# EAGLE design calip2 (EAGLE 7.5.0)
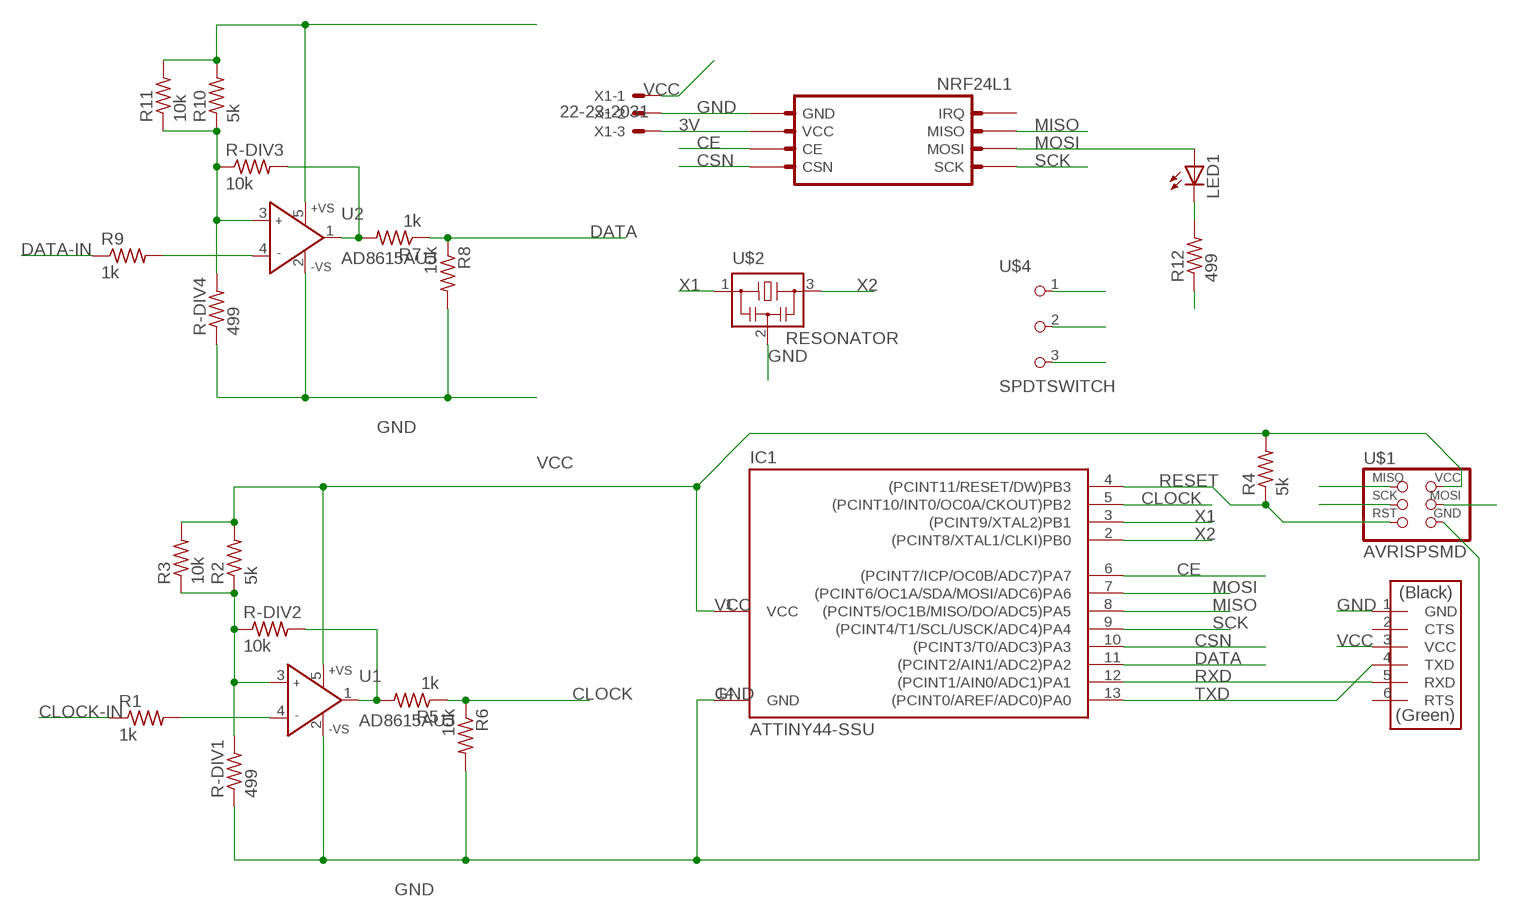
[diagram p0: schematic, sheet 1]

## Parts
IC1  ATTINY44-SSU  [SOIC14]
LED1  LEDSML1206  [SML1206]
NRF24L1  NRF  [NRF]
R1  1k  RES-US1206FAB  [R1206FAB]
R2  5k  RES-US1206FAB  [R1206FAB]
R3  10k  RES-US1206FAB  [R1206FAB]
R4  5k  RES-US1206FAB  [R1206FAB]
R5  1k  RES-US1206FAB  [R1206FAB]
R6  10k  RES-US1206FAB  [R1206FAB]
R7  1k  RES-US1206FAB  [R1206FAB]
R8  10k  RES-US1206FAB  [R1206FAB]
R9  1k  RES-US1206FAB  [R1206FAB]
R10  5k  RES-US1206FAB  [R1206FAB]
R11  10k  RES-US1206FAB  [R1206FAB]
R12  499  RES-US1206FAB  [R1206FAB]
R-DIV1  499  RES-US1206FAB  [R1206FAB]
R-DIV2  10k  RES-US1206FAB  [R1206FAB]
R-DIV3  10k  RES-US1206FAB  [R1206FAB]
R-DIV4  499  RES-US1206FAB  [R1206FAB]
U1  AD8615AUJ  [TSOT23-5]
U2  AD8615AUJ  [TSOT23-5]
U$1  AVRISPSMD  [2X03SMD]
U$2  RESONATOR  [EFOBM]
U$3  FTDI-SMD-HEADER  [1X06SMD]
U$4  SPDTSWITCH  [SPDTSWITCH]
X1  22-23-2031  [22-23-2031]

## Nets
3V: NRF24L1.2(VCC) X1.3
CE: IC1.6((PCINT7/ICP/OC0B/ADC7)PA7) NRF24L1.3(CE)
CLOCK: IC1.5((PCINT10/INT0/OC0A/CKOUT)PB2) R5.1 R6.1
CLOCK-IN: R1.1 U$4.2
CSN: IC1.10((PCINT3/T0/ADC3)PA3) NRF24L1.4(CSN)
DATA: IC1.11((PCINT2/AIN1/ADC2)PA2) R7.1 R8.1
DATA-IN: R9.1 U$4.3
GND: IC1.14(GND) NRF24L1.P$1(GND) R6.2 R8.2 R12.1 R-DIV1.1 R-DIV4.1 U1.2(-VS) U2.2(-VS) U$1.6(GND) U$2.2 U$3.1(GND) U$4.1 X1.2
MISO: IC1.8((PCINT5/OC1B/MISO/DO/ADC5)PA5) NRF24L1.7(MISO) U$1.1(MISO)
MOSI: IC1.7((PCINT6/OC1A/SDA/MOSI/ADC6)PA6) LED1.A NRF24L1.6(MOSI) U$1.4(MOSI)
N$1: R1.2 U1.4(IN-)
N$2: LED1.C R12.2
N$3: R2.1 R3.1 R-DIV1.2 R-DIV2.1 U1.3(IN+)
N$4: R5.2 R-DIV2.2 U1.1(OUT)
N$5: R7.2 R-DIV3.2 U2.1(OUT)
N$7: R10.1 R11.1 R-DIV3.1 R-DIV4.2 U2.3(IN+)
N$9: R9.2 U2.4(IN-)
RESET: IC1.4((PCINT11/RESET/DW)PB3) R4.1 U$1.5(RST)
RXD: IC1.12((PCINT1/AIN0/ADC1)PA1) U$3.5(RXD)
SCK: IC1.9((PCINT4/T1/SCL/USCK/ADC4)PA4) NRF24L1.5(SCK) U$1.3(SCK)
TXD: IC1.13((PCINT0/AREF/ADC0)PA0) U$3.4(TXD)
VCC: IC1.1(VCC) R2.2 R3.2 R4.2 R10.2 R11.2 U1.5(+VS) U2.5(+VS) U$1.2(VCC) U$3.3(VCC) X1.1
X1: IC1.3((PCINT9/XTAL2)PB1) U$2.1
X2: IC1.2((PCINT8/XTAL1/CLKI)PB0) U$2.3
Unconnected: NRF24L1.8(IRQ) U$3.2(CTS) U$3.6(RTS)

## Library data of the parts
IC1 = fab:ATTINY44
LED1 = led:LED: LED OSRAM: - CHIPLED LG R971, LG N971, LY N971, LG Q971, LY Q971, LO R971, LY R971 LH N974, LH R974 LS Q976, LO Q976, LY Q976 LO Q996 - Hyper CHIPLED LW Q18S LB Q993, LB Q99A, LB R99A - SideLED LS A670, LO A670, LY A670, LG A670, LP A670 LB A673, LV A673, LT A673, LW A673 LH A674 LY A675 LS A676, LA A676, LO A676, LY A676, LW A676 LS A679, LY A679, LG A679 - Hyper Micro SIDELED® LS Y876, LA Y876, LO Y876, LY Y876 LT Y87S - SmartLED LW L88C, LW L88S LB L89C, LB L89S, LG L890 LS L89K, LO L89K, LY L89K LS L896, LA L896, LO L896, LY L896 - TOPLED LS T670, LO T670, LY T670, LG T670, LP T670 LSG T670, LSP T670, LSY T670, LOP T670, LYG T670 LG T671, LOG T671, LSG T671 LB T673, LV T673, LT T673, LW T673 LH T674 LS T676, LA T676, LO T676, LY T676, LB T676, LH T676, LSB T676, LW T676 LB T67C, LV T67C, LT T67C, LS T67K, LO T67K, LY T67K, LW E67C LS E67B, LA E67B, LO E67B, LY E67B, LB E67C, LV E67C, LT E67C LW T67C LS T679, LY T679, LG T679 LS T770, LO T770, LY T770, LG T770, LP T770 LB T773, LV T773, LT T773, LW T773 LH T774 LS E675, LA E675, LY E675, LS T675 LS T776, LA T776, LO T776, LY T776, LB T776 LHGB T686 LT T68C, LB T68C - Hyper Mini TOPLED® LB M676 - Mini TOPLED Santana® LG M470 LS M47K, LO M47K, LY M47K Source: http://www.osram.convergy.de LUXEON: - LUMILED® LXK2-PW12-R00, LXK2-PW12-S00, LXK2-PW14-U00, LXK2-PW14-V00 LXK2-PM12-R00, LXK2-PM12-S00, LXK2-PM14-U00 LXK2-PE12-Q00, LXK2-PE12-R00, LXK2-PE12-S00, LXK2-PE14-T00, LXK2-PE14-U00 LXK2-PB12-K00, LXK2-PB12-L00, LXK2-PB12-M00, LXK2-PB14-N00, LXK2-PB14-P00, LXK2-PB14-Q00 LXK2-PR12-L00, LXK2-PR12-M00, LXK2-PR14-Q00, LXK2-PR14-R00 LXK2-PD12-Q00, LXK2-PD12-R00, LXK2-PD12-S00 LXK2-PH12-R00, LXK2-PH12-S00 LXK2-PL12-P00, LXK2-PL12-Q00, LXK2-PL12-R00 Source: www.luxeon.com KINGBRIGHT: KA-3528ASYC Source: www.kingbright.com
NRF24L1 = nrf24:NRF
R1-R12 R-DIV1-R-DIV4 = fab:RES-US: Resistor (US Symbol) Variants with postfix FAB are widened to allow the routing of internal traces
U1 U2 = parts:AD8615: Precision, 20 MHz, CMOS, Rail-to-Rail Input/Output Operational Amplifiers; RS: 796-8925
U$1 = fab:AVRISP
U$2 = fab:RESONATOR
U$3 = fab:FTDI-SMD-HEADER
U$4 = fab:SPDTSWITCH
X1 = con-molex:22-23-2031: .100" (2.54mm) Center Header - 3 Pin; MF: MOLEX; MPN: 22-23-2031; OC_FARNELL: 1462950; OC_NEWARK: 30C0862

## Board
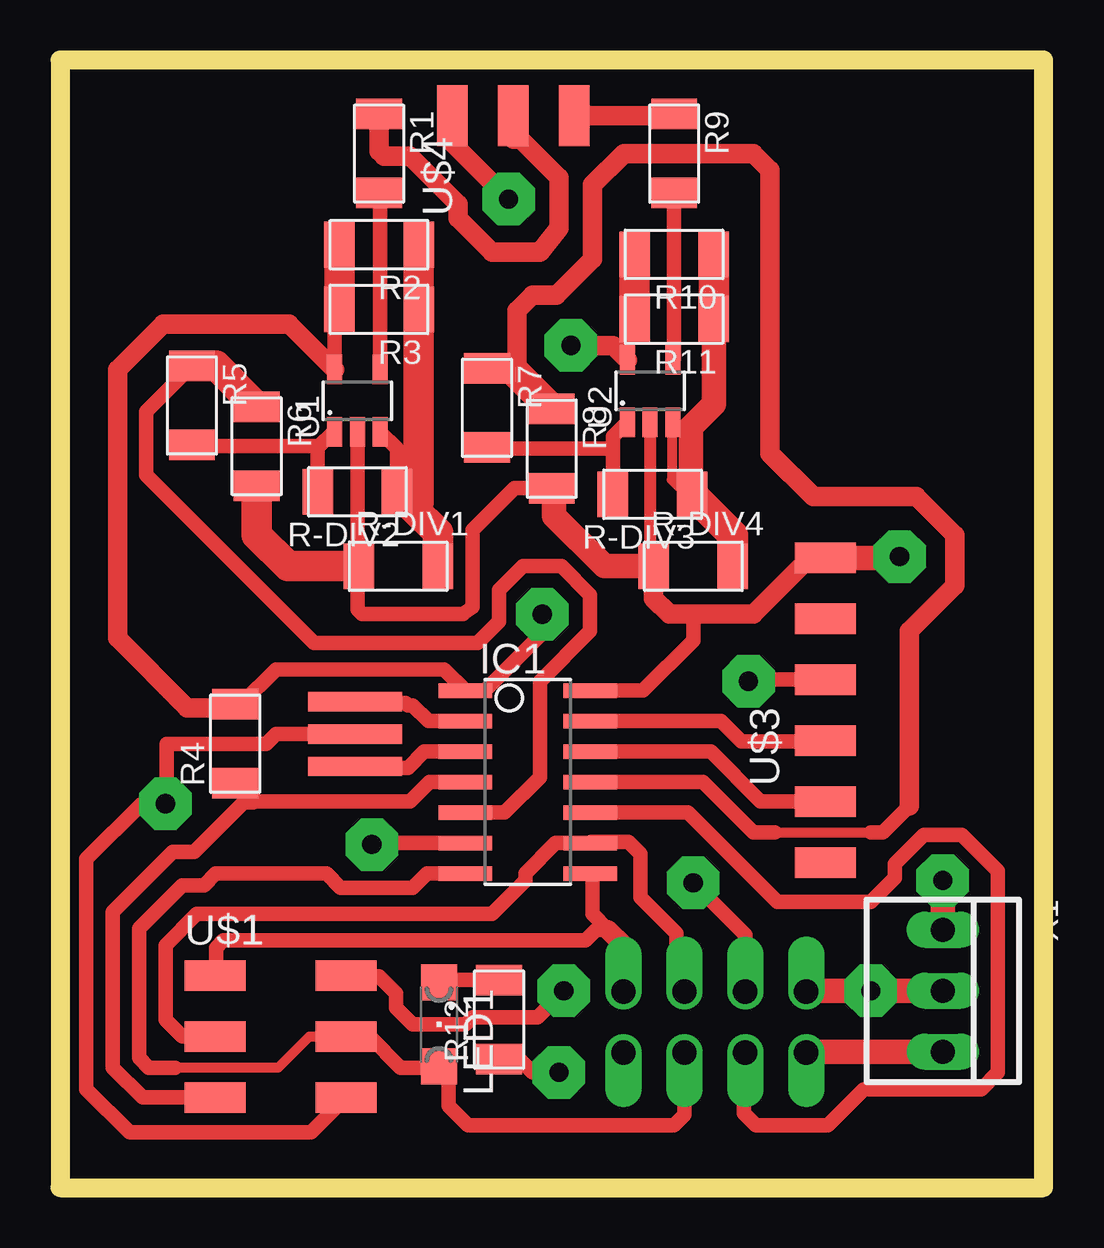
[diagram p1: board, top side]
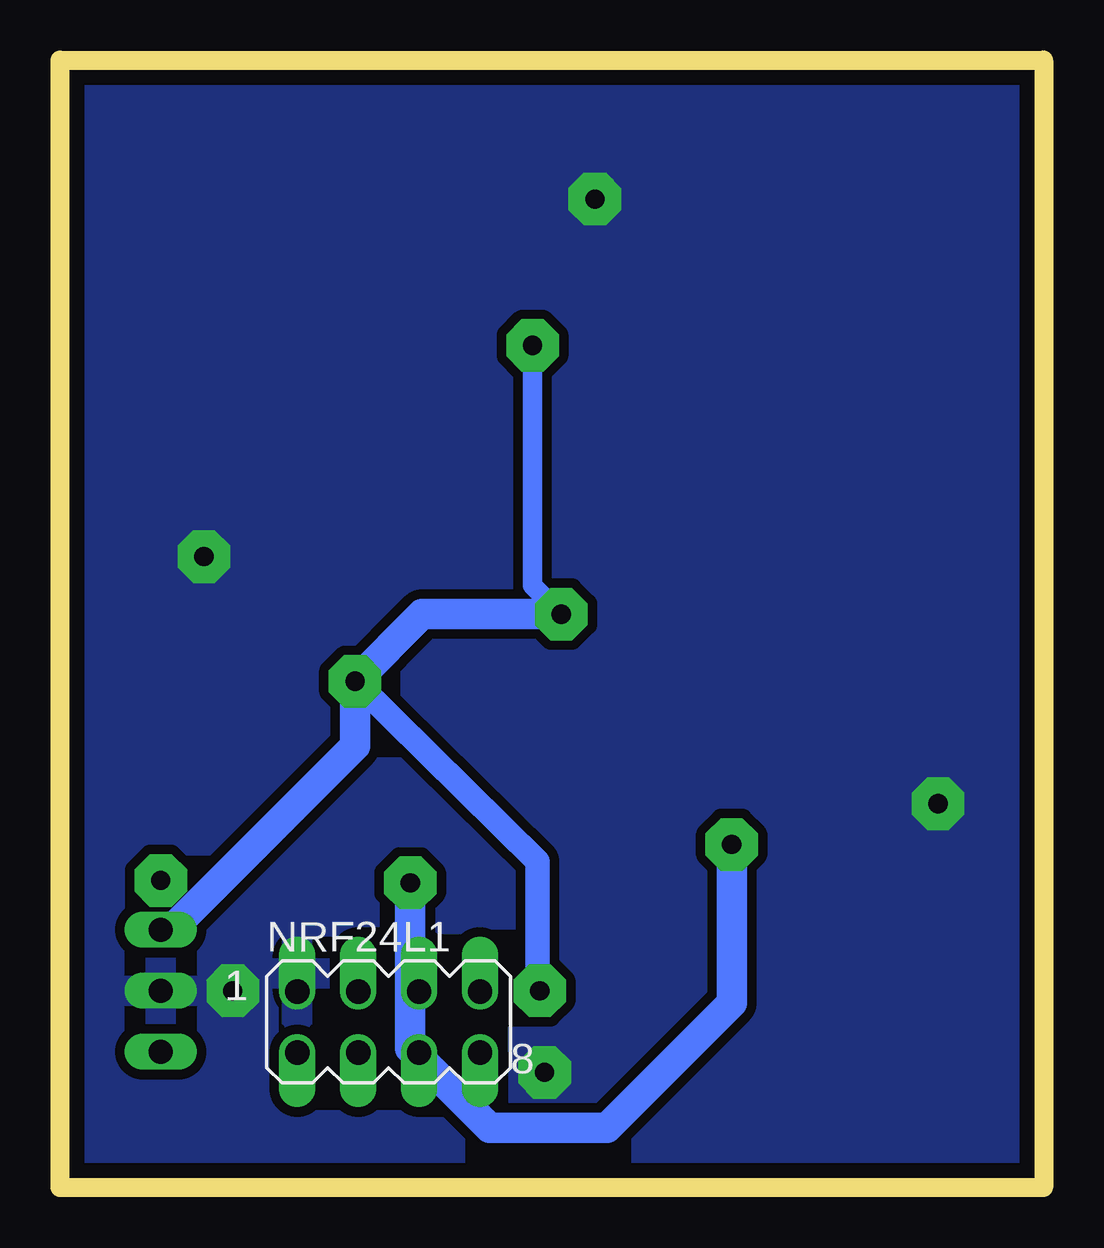
[diagram p2: board, bottom side, seen from below]

Size 41 x 47 mm. Coordinates in mm from the lower left corner, seen from the top.
Outline: 0,0 41,0 41,47 0,47 0,0
Copper layers (1*16): Top 0.035mm / dielectric 1.5mm / Bottom 0.035mm
Design rules "default *": minimum track width 0.4mm, minimum drill 0.8mm, track to track 0.4mm, track to pad 0.4mm, pad to pad 0.4mm, via to via 0.4mm, smd to smd 0mil, copper to edge 40mil, drill to drill 8mil, minimum pad ring 10mil, minimum via ring 8mil, stop-mask expansion 4mil, vias tented up to drill 0mil, thermal gap 10mil
Milling: 4 lines

### Footprints (pad centres in the part's own frame; a part is rotated, then mirrored left to right if it is on the bottom)
SOIC14 = smd 0.61 x 2.21: 1 -3.81,-2.603; 2 -2.54,-2.603; 3 -1.27,-2.603; 4 0,-2.603; 5 1.27,-2.603; 6 2.54,-2.603; 7 3.81,-2.603; 8 3.81,2.603; 9 2.54,2.603; 10 1.27,2.603; 11 0,2.603; 12 -1.27,2.603; 13 -2.54,2.603; 14 -3.81,2.603
SML1206 = smd 1.5 x 1.5: A 1.75,0; C -1.75,0
NRF = drill 1.016 offset: 2 -3.81,-1.27; 3 -1.27,1.27; 4 -1.27,-1.27; 5 1.27,1.27; 6 1.27,-1.27; 7 3.81,1.27; 8 3.81,-1.27; P$1 -3.81,1.27
R1206FAB = smd 1.27 x 1.905: 1 -1.651,0; 2 1.651,0
TSOT23-5 = smd 0.62 x 1.22: 1 -0.95,-1.3; 2 0,-1.3; 3 0.95,-1.3; 4 0.95,1.3; 5 -0.95,1.3
2X03SMD = smd 2.54 x 1.27: 1 -2.54,2.54; 2 2.92,2.54; 3 -2.54,0; 4 2.92,0; 5 -2.54,-2.54; 6 2.92,-2.54
EFOBM = smd 0.8 x 3.9: 1 -1.35,0; 2 0,0; 3 1.35,0
1X06SMD = smd 2.54 x 1.27: 1 0,6.35; 2 0,3.81; 3 0,1.27; 4 0,-1.27; 5 0,-3.81; 6 0,-6.35
SPDTSWITCH = smd 2.54 x 1.27: 1 0.38,2.54; 2 0.38,0; 3 0.38,-2.54
22-23-2031 = drill 1 long: 1 -2.54,0; 2 0,0; 3 2.54,0

### Placement (x,y rotation side)
IC1  19.5,16.9 270 top
LED1  15.8,6.8 270 top
NRF24L1  27.3,6.9 0 bottom
R1  13.3,43.1 270 top
R2  13.3,39.3 180 top
R3  13.3,36.6 180 top
R4  7.3,18.5 90 top
R5  5.5,32.6 270 top
R6  8.2,30.9 270 top
R7  17.8,32.5 270 top
R8  20.5,30.8 270 top
R9  25.6,43.1 270 top
R10  25.6,38.9 180 top
R11  25.6,36.2 180 top
R12  18.3,7 90 top
R-DIV1  14.1,25.9 0 top
R-DIV2  12.4,29 180 top
R-DIV3  24.7,28.9 180 top
R-DIV4  26.4,25.9 0 top
U1  12.4,32.8 0 top
U2  24.6,33.2 0 top
U$1  9,6.3 0 top
U$2  12.3,18.9 90 top
U$3  31.9,19.9 0 top
U$4  18.9,44.3 90 top
X1  36.8,8.2 270 top

### Tracks (layer width: path | path; a pad name or v marks a point on that pad's centre or on a via)
3V
  Top 1.016: X1.3 31.14,5.66 NRF24L1.2
CE  (via drill 0.8 pad 2.18)
  Top 0.61: IC1.6 13.06,14.36 v13,14.3 | NRF24L1.3 28.57,10.53 v26.4,12.7
  Bottom 1.27: v13,14.3 13,7.7 18.2,2.5 23.1,2.5 26.4,5.8 v26.4,12.7
CLOCK
  Top 0.4: 5.4,33.9 R5.1
  Top 0.61: R5.1 3.6,32.35 3.6,29.7 10.6,22.7 17.4,22.7 18.3,23.6 18.3,24.9 19.3,25.9 20.9,25.9 22.1,24.7 22.1,23.2 20,21.1 20,17.1 18.53,15.63 IC1.5
  Top 1.27: R6.1 6.5,34.25 R5.1
CLOCK-IN
  Top 0.813: U$4.2 18.9,43.7 19.2,43.7 20.8,42.1 20.8,40 20,39 18,39 16.6,40.4 16.6,41 14.6,43 13.5,43 13.3,43.2 R1.1
CSN
  Top 0.61: IC1.10 26.17,15.63 29.9,11.9 33.8,11.9 34.8,12.9 34.8,13.5 36,14.7 37.6,14.7 39.1,13.2 39.1,4.8 38.4,4.1 33.5,4.1 32,2.6 29,2.6 28.5,3.1 28.5,5.56 NRF24L1.4
DATA
  Top 0.406: 29.8,14.8 33.8,14.8
  Top 0.61: 29.8,14.8 28.9,14.8 26.8,16.9 IC1.11 | 33.8,14.8 34.3,14.8 35.4,15.9
  Top 0.813: 35.4,15.9 35.4,23.2 37.3,25.1 37.3,27.2 35.7,28.8 31.4,28.8 29.6,30.6 29.6,42.4 28.9,43.1 23.5,43.1 22.2,41.8 22.2,38.7 20.7,37.2 19.7,37.2 19.05,36.55 19.05,34.15 18.8,34.15
  Top 1.27: R7.1 18.8,34.15 R8.1
DATA-IN
  Top 0.813: U$4.3 25.53,44.68 25.53,44.75 R9.1
GND  (via drill 0.8 pad 2.18)
  Top 0.4: 12.4,25.4 R-DIV1.1 | 20.2,29.3 R8.2
  Top 0.5: U2.2 24.6,26.05
  Top 0.61: 24.6,26.05 R-DIV4.1 | U1.2 12.4,26.9 12.45,26.85 R-DIV1.1 | U$2.2 9,18.9 8.6,18.5 4.45,18.5 4.45,16.05 v4.4,16 3.4,16 1.1,13.7 1.1,4.1 2.9,2.3 10.46,2.3 U$1.6 | IC1.14 24.31,20.71 26.4,22.8 26.4,23.9 | 12.4,25.4 12.4,24.1 12.6,23.9 16.8,23.9 17.2,24.2 17.2,27.4 18.95,29.15 R8.2 | R12.1 19.15,5.35 19.7,4.8 v20.8,4.8
  Top 0.813: R-DIV4.1 24.75,24.55 25.4,23.9 26.4,23.9 28.9,23.9 31.2,26.2 31.85,26.2 U$3.1 | U$4.1 16.3,44.62 16.3,43.6 v18.7,41.2
  Top 1.016: 31.1,8.2 v33.8,8.2 | v33.8,8.2 33.9,8.2 | X1.2 v33.8,8.2 | U$3.1 34.95,26.25 v35,26.3 | R8.2 20.6,29.05 20.6,28 22.7,25.9 R-DIV4.1
  Top 1.27: R-DIV1.1 9.5,25.9 8.2,27.2 R6.2
  pour Bottom: 0,47 41,47 41,0 0,0
MISO
  Top 0.4: 6.3,9.05 U$1.1
  Top 0.61: 6.3,9 U$1.1 6.5,8.88 6.5,10 6.8,10.3 21.9,10.3 22.35,10.75 22.85,10.75 22.2,11.4 22.2,12.99 IC1.8
  Top 0.813: 22.85,10.75 23.5,10.1 23.49,10.09 NRF24L1.7
MOSI
  Top 0.4: 12.05,6.3 U$1.4
  Top 0.406: U$1.4 10.4,6.3 9.1,5 4.8,5
  Top 0.61: 26,5.6 NRF24L1.6 26.03,3.03 25.6,2.6 17,2.6 16.2,3.4 16.2,4.95 LED1.A 15.75,5 14.2,5 12.9,6.3 12.05,6.3 | IC1.7 16.89,13.1 15.3,13.1 14.7,12.5 11.7,12.5 11.11,13.09 6.49,13.09 6,12.6 5.1,12.6 3.3,10.8 3.3,5.4 3.7,5 4.8,5
N$1
  Top 0.61: R1.2 13.35,41.4 U1.4
N$2
  Top 0.61: 18.1,8.85 R12.2 15.9,8.65 LED1.C
N$3
  Top 0.61: U1.3 14.05,30.8 R-DIV2.1
  Top 1.27: R-DIV1.2 15.75,27.3 14.73,28.33 | 14.73,28.33 R-DIV2.1 | R2.1 R3.1 14.95,28.55 14.73,28.33
N$4
  Top 0.61: R5.2 5.55,30.9 10.8,30.9 | 10.8,30.9 11.4,31.5 U1.1 | 10.8,30.9 10.75,30.85 R-DIV2.2
N$5
  Top 0.61: U2.1 23.05,31.3 23.05,30.8 | 23.05,30.8 R-DIV3.2 | R7.2 17.85,30.8 23.05,30.8
N$7
  Top 0.406: U2.3 25.5,31.85 25.5,29.5 26.1,28.9 R-DIV3.1
  Top 0.61: 26.5,29.05 R-DIV3.1
  Top 1.016: R11.1 27.25,32.65 26.3,31.7 26.3,28.95 R-DIV3.1
  Top 1.27: R10.1 R11.1 | R-DIV3.1 28.05,27.2 R-DIV4.2
N$9
  Top 0.61: R9.2 25.6,34.55 U2.4
RESET
  Top 0.61: 8.05,16.1 R4.1 7.6,16.55 | 8.05,16.1 14.6,16.1 15.4,16.9 IC1.4 | U$1.5 3.44,3.76 2.2,5 2.2,11.5 4.7,14 5.6,14 7.65,16.05 8.05,16.05 8.05,16.1
RXD
  Top 0.61: 31.81,16 U$3.5 29.2,16.1 27.13,18.17 IC1.12
SCK
  Top 0.61: 26,8.2 NRF24L1.5 25.7,8.5 25.7,10.6 24.2,12.1 24.2,13.9 23.7,14.4 22.14,14.4 IC1.9 20.66,14.36 19.4,13.1 19.4,12.8 18,11.4 5.7,11.4 4.4,10.1 4.4,7 5.1,6.3 U$1.3
TXD
  Top 0.61: IC1.13 27.56,19.44 28.4,18.6 31.87,18.6 U$3.4
VCC  (via drill 0.8 pad 2.18)
  Top 0.4: 11.4,35.9 R3.2
  Top 0.61: U1.5 11.45,36.4 R3.2 | R4.2 7.55,20.15 9,21.6 16.01,21.6 IC1.1 17.7,20.7 20.1,23.1 v20.1,23.9 | v28.7,21.1 28.77,21.17 U$3.3 | U$1.2 11.96,8.8 13.3,8.8 14,8.1 14,7.5 14.7,6.8 16.9,6.8 17.2,7.1 19.9,7.1 v21,8.2 | R11.2 23.65,36.8 U2.5
  Top 0.813: U1.5 9.55,36 4.3,36 2.4,34.1 2.4,22.9 5.3,20 7.15,20 R4.2 | U2.5 23.05,35.1 v21.3,35.1
  Top 1.016: v36.8,12.8 X1.1
  Top 1.27: R2.2 R3.2 | R10.2 R11.2
  Bottom 0.813: v21.3,35.1 21.3,25.1 v20.1,23.9
  Bottom 1.016: v28.7,21.1 21.1,13.6 21.1,8.8 v21,8.2
  Bottom 1.27: v20.1,23.9 25.9,23.9 v28.7,21.1 28.7,18.4 36.36,10.74 X1.1
X1
  Top 0.61: IC1.3 15.17,18.17 14.5,17.5 12.35,17.5 U$2.1
X2
  Top 0.61: IC1.2 15.36,19.44 14.7,20.1 14.5,20.1 14.4,20.2 12.35,20.2 U$2.3